# Altium schematic sheet LEDDrivers.SchDoc
size A4
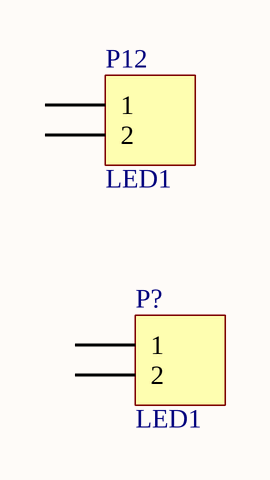
[diagram p0: LEDDrivers.SchDoc]

## Parts
P12  LED1  [HDR1X2]
P?  LED1  [HDR1X2]

## Nets

Not connected (* = marked no-connect by the designer): P12 1 2; P? 1 2

## Library data of the parts
P12 P? = Header 2: Header, 2-Pin; LatestRevisionDate: 17-Jul-2002; LatestRevisionNote: Re-released for DXP Platform.; Publisher: Altium Limited